# Altium schematic sheet POWER_SUPPLY.SchDoc
size 762 x 381 mm; SheetNumber: 3; SheetTotal: 8; SPICEModelCacheBEUKSOBP: <root> / <DocumentId>BEUKSOBP</DocumentId> / <CacheFrame Number="0"> / <Model Name="865230657013_100uf" Kind="CKT"> / <Text>******* / .subckt 865230657013_100uF 1 2 / Rser 1 3 0.189 / Lser 2 4 5.72884434804354E-09 / C1 3 4 0.0001 / Rpar 3 4 1000000 / .ends 865230657013_100uF</Text> / </Model> / <Model Name="861011483001_47uf" Kind="CKT"> / <Text>***** / .subckt 861011483001_47uF 1 2 / Rser 1 3 0.592 / Lser 2 4 1.3511713379E-08 / C1 3 4 0.000047 / Rpar 3 4 1063829.78723404 / .ends 861011483001_47uF</Text> / </Model> / <Model Name="861011386030_0.47mf" Kind="CKT"> / <Text>***** / .subckt 861011386030_0.47mF 1 2 / Rser 1 3 0.17265 / Lser 2 4 1.3520559628E-08 / C1 3 4 0.00047 / Rpar 3 4 106382.978723404 / .ends 861011386030_0.47mF</Text> / </Model> / <Model Name="861011486024_0.47mf" Kind="CKT"> / <Text>***** / .subckt 861011486024_0.47mF 1 2 / Rser 1 3 0.076 / Lser 2 4 9.10992922174604E-09 / C1 3 4 0.00047 / Rpar 3 4 106382.978723404 / .ends 861011486024_0.47mF</Text> / </Model> / <Model Name="860241478003_10uf" Kind="CKT"> / <Text>******* / .subckt 860241478003_10uF 1 2 / Rser 1 3 1.01763676485 / Lser 2 4 9.918160074E-09 / C1 3 4 0.00001 / Rpar 3 4 10000000 / .ends 860241478003_10uF</Text> / </Model> / <Model Name="860240578009_330uf" Kind="CKT"> / <Text>******* / .subckt 860240578009_330uF 1 2 / Rser 1 3 0.092 / Lser 2 4 0.000000007 / C1 3 4 0.00033 / Rpar 3 4 303030.303030303 / .ends 860240578009_330uF</Text> / </Model> / <Model Name="875075661010_330uf" Kind="CKT"> / <Text>******* / .subckt 875075661010_330uF 1 2 / Rser 1 3 0.0146833185075 / Lser 2 4 5.45495338E-09 / C1 3 4 0.00033 / Rpar 3 4 15151.5151515152 / .ends 875075661010_330uF</Text> / </Model> / <Model Name="861011384014_0.22mf" Kind="CKT"> / <Text>***** / .subckt 861011384014_0.22mF 1 2 / Rser 1 3 0.31844 / Lser 2 4 1.4863233484E-08 / C1 3 4 0.00022 / Rpar 3 4 227272.727272727 / .ends 861011384014_0.22mF</Text> / </Model> / <Model Name="865080657018_220uf" Kind="CKT"> / <Text>******* / .subckt 865080657018_220uF 1 2 / Rser 1 3 0.154 / Lser 2 4 2.1311583677206E-08 / C1 3 4 0.00022 / Rpar 3 4 454545.454545455 / .ends 865080657018_220uF</Text> / </Model> / </CacheFrame> / </root>
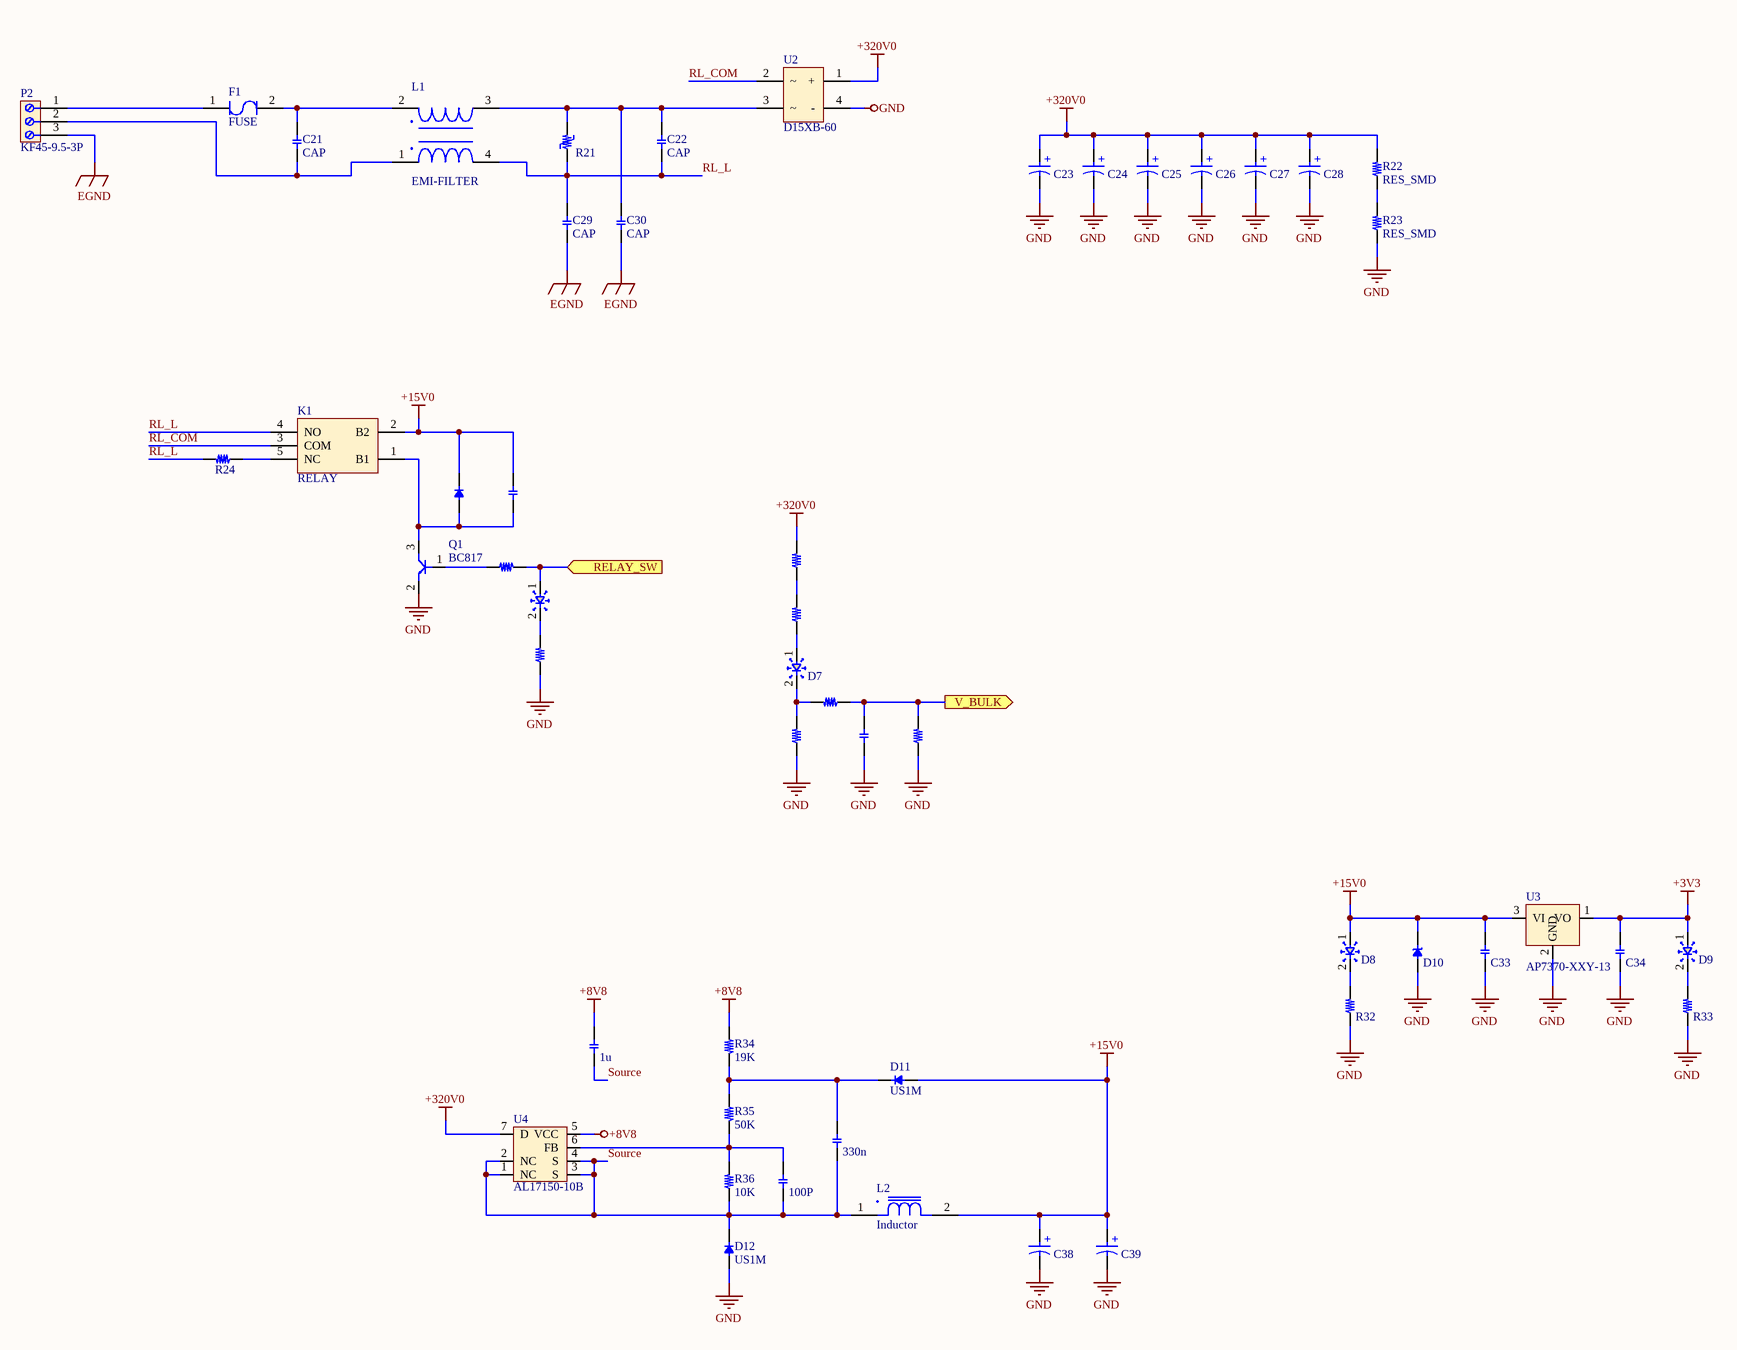
[diagram p0: POWER_SUPPLY.SchDoc]

## Parts
C21  CAP  [C FILM 15mm]
C22  CAP  [C FILM 15mm]
C23  220µF  [WCAP-AIG8_D25H30]  (value not drawn)
C24  220µF  [WCAP-AIG8_D25H30]  (value not drawn)
C25  220µF  [WCAP-AIG8_D25H30]  (value not drawn)
C26  220µF  [WCAP-AIG8_D25H30]  (value not drawn)
C27  220µF  [WCAP-AIG8_D25H30]  (value not drawn)
C28  220µF  [WCAP-AIG8_D25H30]  (value not drawn)
C29  CAP  [CXY]
C30  CAP  [CXY]
C31  CAP_SMD  [C 0603]  (value not drawn)
C32  CAP_SMD  [C 1206]  (value not drawn)
C33  CAP_SMD  [C 0603]  (value not drawn)
C34  CAP_SMD  [C 0603]  (value not drawn)
C35  1u  [C 1206]
C36  330n  [C 1206]
C37  100P  [C 1206]
C38  220uF  [WCAP-ASLI_D10H10.5]  (value not drawn)
C39  220uF  [WCAP-ASLI_D10H10.5]  (value not drawn)
D5  DIOD_SMD  [D SOD-323]  (value not drawn)
D6  LED_SMD  [D 0603]  (value not drawn)
D7  LED_SMD  [D 1206]  (value not drawn)
D8  LED_SMD  [D 0603]  (value not drawn)
D9  LED_SMD  [D 0603]  (value not drawn)
D10  TVS_UI  [D SOD-123]  (value not drawn)
D11  US1M  [DIOD_SMA]
D12  US1M  [DIOD_SMA]
F1  FUSE  [FUSE 1]
K1  RELAY  [ALQ124]
L1  EMI-FILTER  [EMI-FILTER-10*13]
L2  Inductor  [L_10*10_SMD]
P2  KF45-9.5-3P  [DG45C-B-03P-13]
Q1  BC817  [SOT-23_3_Q]
R21  VARISTOR  [RTD]  (value not drawn)
R22  RES_SMD  [R 2512]
R23  RES_SMD  [R 2512]
R24  RES_THD  [R 5W VER]  (value not drawn)
R25  RES_SMD  [R 1206]  (value not drawn)
R26  RES_SMD  [R 0603]  (value not drawn)
R27  RES_SMD  [R 1206]  (value not drawn)
R28  RES_SMD  [R 0603]  (value not drawn)
R29  RES_SMD  [R 1206]  (value not drawn)
R30  RES_SMD  [R 1206]  (value not drawn)
R31  RES_SMD  [R 0603]  (value not drawn)
R32  RES_SMD  [R 0603]  (value not drawn)
R33  RES_SMD  [R 0603]  (value not drawn)
R34  19K  [R 1206]
R35  50K  [R 1206]
R36  10K  [R 1206]
U2  D15XB-60  [D15XB-60]
U3  AP7370-XXY-13  [SOT89-U]
U4  AL17150-10B  [SOIC-7]

## Ports
RELAY_SW (in), V_BULK (out)

## Nets
+3V3: C34.2 D9.1 U3.1(VO)
+8V8: C35.2 R34.1 U4.5(VCC)
+15V0: C31.2 C33.2 C38.1(P) C39.1(P) D5.2 D8.1 D10.2 D11.1 K1.2(B2) L2.2 U3.3(VI)
+320V0: C23.1(P) C24.1(P) C25.1(P) C26.1(P) C27.1(P) C28.1(P) R22.2 R25.2 U2.1(+) U4.7(D)
EGND: C29.1 C30.1 P2.3
GND: C23.2(N) C24.2(N) C25.2(N) C26.2(N) C27.2(N) C28.2(N) C32.1 C33.1 C34.1 C38.2(N) C39.2(N) D10.1 D12.1 Q1.2(E) R23.1 R28.1 R30.1 R31.1 R32.1 R33.1 U2.4(-) U3.2(GND)
RELAY_SW: D6.1 R26.2 ; port RELAY_SW
RL_COM: K1.3(COM) U2.2
RL_L: C22.1 C29.2 K1.4(NO) L1.4 R21.1 R24.2
Source: C35.1 C36.1 C37.1 D12.2 L2.1 R36.1 U4.1(NC) U4.2(NC) U4.3(S) U4.4(S)
V_BULK: C32.2 R29.1 R31.2 ; port V_BULK
NetC21_1: C21.1 L1.1 P2.2
NetC21_2: C21.2 F1.2 L1.2
NetC22_2: C22.2 C30.2 L1.3 R21.2 U2.3
NetC31_1: C31.1 D5.1 K1.1(B1) Q1.3(C)
NetC36_2: C36.2 D11.2 R34.2 R35.1
NetC37_2: C37.2 R35.2 R36.2 U4.6(FB)
NetD6_2: D6.2 R28.2
NetD7_1: D7.1 R27.1
NetD7_2: D7.2 R29.2 R30.2
NetD8_2: D8.2 R32.2
NetD9_2: D9.2 R33.2
NetF1_1: F1.1 P2.1
NetK1_5: K1.5(NC) R24.1
NetQ1_1: Q1.1(B) R26.1
NetR22_1: R22.1 R23.2
NetR25_1: R25.1 R27.2

## Notes on the sheet
- (in symbol 861011384014) +
- (in symbol 865080657018) +

## Library data of the parts
C23-C28 = 861011384014: WCAP-AIG8 Aluminum Electrolytic Capacitor, Snap-In, D25 x H30mm, 220µF, 400V; Manufacturer: Wurth Elektronik; Capacitance Tolerance: +/-20%; Dissipation Factor: 20%; Endurance: 2000h; Leakage Current: 1760µA; Ripple Current: 1550mA; Technical Reference: ANAO300221M400DSIC3B000; Manufacturer Part Number: 861011384014; Category: Aluminum Electrolytic Capacitors; Match Code: WCAP-AIG8; ComponentLink1Description: Website Link; ComponentLink1URL: https://www.we-online.com/redexpert/article/861011384014?ad; ComponentLink2Description: Datasheet Link; ComponentLink2URL: https://www.we-online.com/redexpert/spec/861011384014?ad; Mount: Through Hole; Operating Temperature Max: 85°C; Operating Temperature Min: -25°C; Packaging: Tray; Height: 30mm; Diameter: 25mm; Capacitance: 220µF; Rated Voltage (DC): 400V
C35-C37 = CAP_SMD
C38 C39 = 865080657018: WCAP-ASLI Aluminum Electrolytic Capacitor, V-Chip, D10 x H10.5mm, 220uF, 50V; Manufacturer: Wurth Elektronik; Capacitance Tolerance: +/-20%; Dissipation Factor: 12%; Endurance: 2000h; Leakage Current: 110uA; Ripple Current: 650mA; Technical Reference: ASEF105221M050DVCTEB000; Manufacturer Part Number: 865080657018; Category: Aluminum Electrolytic Capacitors; Match Code: WCAP-ASLI; ComponentLink1Description: Website Link; ComponentLink1URL: https://www.we-online.com/redexpert/article/865080657018?ad; ComponentLink2Description: Datasheet Link; ComponentLink2URL: https://www.we-online.com/redexpert/spec/865080657018?ad; Mount: Surface Mount; Operating Temperature Max: 105°C; Operating Temperature Min: -55°C; Packaging: Tape and Reel; Height: 10.5mm; Diameter: 10mm; Capacitance: 220uF; Rated Voltage (DC): 50V
D10 = DIOD_SMD_TVS_UI
D11 D12 = DIOD_SMD
R34-R36 = RES_SMD